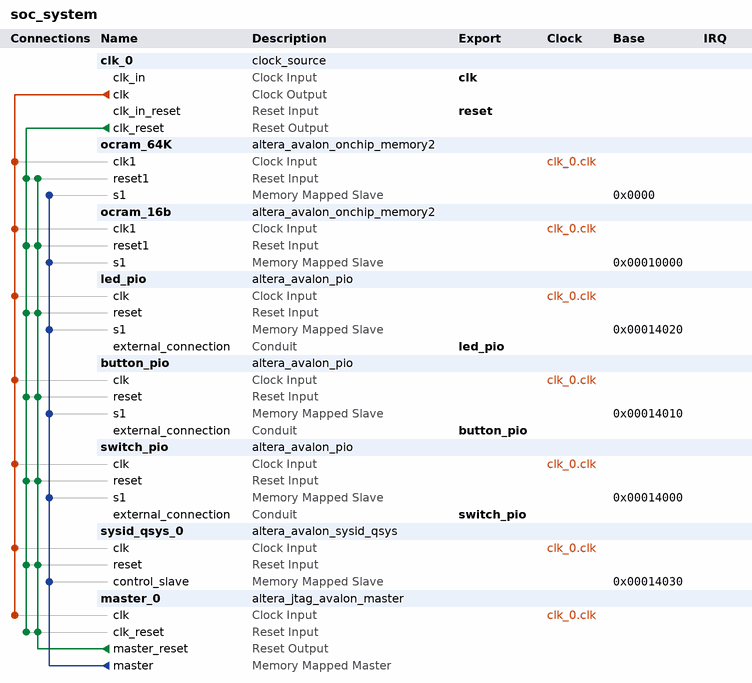
[diagram p0: system contents]
# Platform Designer (Qsys) system soc_system, Cyclone V 5CSEMA5F31C6
# Parameters at their usual value, and those the tool derives, are not listed.
package require -exact qsys 18.1
create_system soc_system
set_project_property DEVICE_FAMILY {Cyclone V}
set_project_property DEVICE 5CSEMA5F31C6

add_instance clk_0 clock_source 18.1
set_instance_parameter_value clk_0 clockFrequency 50000000

add_instance ocram_64K altera_avalon_onchip_memory2 18.1
set_instance_parameter_value ocram_64K dataWidth 32
set_instance_parameter_value ocram_64K dualPort false
set_instance_parameter_value ocram_64K initMemContent true
set_instance_parameter_value ocram_64K initializationFileName onchip_mem.hex
set_instance_parameter_value ocram_64K memorySize 65536

add_instance ocram_16b altera_avalon_onchip_memory2 18.1
set_instance_parameter_value ocram_16b dataWidth 32
set_instance_parameter_value ocram_16b dualPort false
set_instance_parameter_value ocram_16b initMemContent true
set_instance_parameter_value ocram_16b initializationFileName onchip_mem.hex
set_instance_parameter_value ocram_16b memorySize 16384

add_instance led_pio altera_avalon_pio 18.1
set_instance_parameter_value led_pio direction Output
set_instance_parameter_value led_pio width 4

add_instance button_pio altera_avalon_pio 18.1
set_instance_parameter_value button_pio direction Input
set_instance_parameter_value button_pio width 4

add_instance switch_pio altera_avalon_pio 18.1
set_instance_parameter_value switch_pio direction Input
set_instance_parameter_value switch_pio width 3

add_instance sysid_qsys_0 altera_avalon_sysid_qsys 18.1
set_instance_parameter_value sysid_qsys_0 id -569319920

add_instance master_0 altera_jtag_avalon_master 18.1

# connections
add_connection clk_0.clk button_pio.clk clock
add_connection clk_0.clk led_pio.clk clock
add_connection clk_0.clk master_0.clk clock
add_connection clk_0.clk ocram_16b.clk1 clock
add_connection clk_0.clk ocram_64K.clk1 clock
add_connection clk_0.clk switch_pio.clk clock
add_connection clk_0.clk sysid_qsys_0.clk clock
add_connection clk_0.clk_reset button_pio.reset reset
add_connection clk_0.clk_reset led_pio.reset reset
add_connection clk_0.clk_reset master_0.clk_reset reset
add_connection clk_0.clk_reset ocram_16b.reset1 reset
add_connection clk_0.clk_reset ocram_64K.reset1 reset
add_connection clk_0.clk_reset switch_pio.reset reset
add_connection clk_0.clk_reset sysid_qsys_0.reset reset
add_connection master_0.master_reset button_pio.reset reset
add_connection master_0.master_reset led_pio.reset reset
add_connection master_0.master_reset master_0.clk_reset reset
add_connection master_0.master_reset ocram_16b.reset1 reset
add_connection master_0.master_reset ocram_64K.reset1 reset
add_connection master_0.master_reset switch_pio.reset reset
add_connection master_0.master_reset sysid_qsys_0.reset reset
add_connection master_0.master button_pio.s1 avalon
set_connection_parameter_value master_0.master/button_pio.s1 baseAddress 0x00014010
add_connection master_0.master led_pio.s1 avalon
set_connection_parameter_value master_0.master/led_pio.s1 baseAddress 0x00014020
add_connection master_0.master ocram_16b.s1 avalon
set_connection_parameter_value master_0.master/ocram_16b.s1 baseAddress 0x00010000
set_connection_parameter_value master_0.master/ocram_16b.s1 defaultConnection true
add_connection master_0.master ocram_64K.s1 avalon
set_connection_parameter_value master_0.master/ocram_64K.s1 baseAddress 0x0000
add_connection master_0.master switch_pio.s1 avalon
set_connection_parameter_value master_0.master/switch_pio.s1 baseAddress 0x00014000
add_connection master_0.master sysid_qsys_0.control_slave avalon
set_connection_parameter_value master_0.master/sysid_qsys_0.control_slave baseAddress 0x00014030

# exported interfaces
add_interface button_pio conduit end
set_interface_property button_pio EXPORT_OF button_pio.external_connection
add_interface clk clock sink
set_interface_property clk EXPORT_OF clk_0.clk_in
add_interface led_pio conduit end
set_interface_property led_pio EXPORT_OF led_pio.external_connection
add_interface reset reset sink
set_interface_property reset EXPORT_OF clk_0.clk_in_reset
add_interface switch_pio conduit end
set_interface_property switch_pio EXPORT_OF switch_pio.external_connection

set_interconnect_requirement {$system} qsys_mm.clockCrossingAdapter HANDSHAKE
set_interconnect_requirement {$system} qsys_mm.enableEccProtection FALSE
set_interconnect_requirement {$system} qsys_mm.insertDefaultSlave FALSE
set_interconnect_requirement {$system} qsys_mm.maxAdditionalLatency 1

save_system soc_system.qsys
